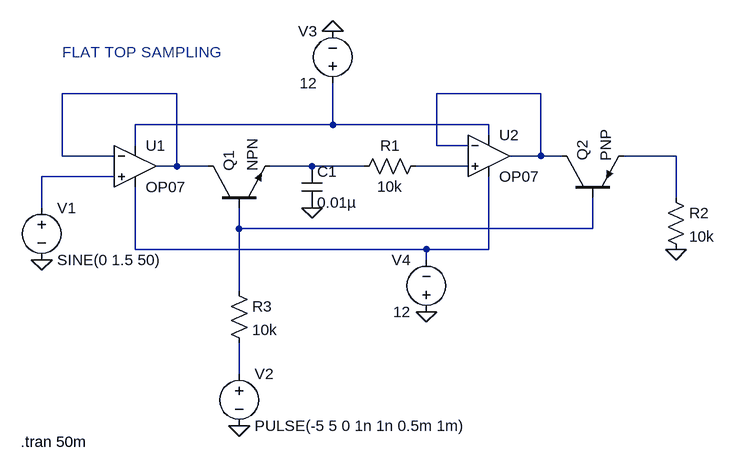
[diagram p0: schematic Flat_top_sampling.asc]
Flat_top_sampling.asc, the LTspice schematic file:
Version 4
SHEET 1 880 680
WIRE 16 32 -160 32
WIRE 576 32 416 32
WIRE 256 80 256 16
WIRE 256 80 -48 80
WIRE 496 80 256 80
WIRE 496 96 496 80
WIRE -48 112 -48 80
WIRE 416 112 416 32
WIRE 464 112 416 112
WIRE -160 128 -160 32
WIRE -80 128 -160 128
WIRE 576 128 576 32
WIRE 576 128 528 128
WIRE 608 128 576 128
WIRE 784 128 704 128
WIRE 16 144 16 32
WIRE 16 144 -16 144
WIRE 64 144 16 144
WIRE 224 144 160 144
WIRE 304 144 224 144
WIRE 464 144 384 144
WIRE -80 160 -192 160
WIRE 784 192 784 128
WIRE -192 208 -192 160
WIRE 112 240 112 208
WIRE 656 240 656 192
WIRE 656 240 112 240
WIRE -48 272 -48 176
WIRE 400 272 -48 272
WIRE 496 272 496 160
WIRE 496 272 400 272
WIRE 400 288 400 272
WIRE 112 336 112 240
WIRE 112 464 112 416
FLAG -192 288 0
FLAG 112 544 0
FLAG 224 208 0
FLAG 784 272 0
FLAG 400 368 0
FLAG 256 -64 0
SYMBOL OpAmps\\OP07 -48 80 R0
SYMATTR InstName U1
SYMBOL OpAmps\\OP07 496 64 R0
SYMATTR InstName U2
SYMBOL voltage -192 192 R0
WINDOW 123 0 0 Left 0
WINDOW 39 0 0 Left 0
SYMATTR InstName V1
SYMATTR Value SINE(0 1.5 50)
SYMBOL npn 64 208 R270
SYMATTR InstName Q1
SYMBOL res 400 128 R90
WINDOW 0 0 56 VBottom 2
WINDOW 3 32 56 VTop 2
SYMATTR InstName R1
SYMATTR Value 10k
SYMBOL cap 208 144 R0
SYMATTR InstName C1
SYMATTR Value 0.01µ
SYMBOL pnp 608 192 R270
SYMATTR InstName Q2
SYMBOL res 768 176 R0
SYMATTR InstName R2
SYMATTR Value 10k
SYMBOL voltage 112 448 R0
WINDOW 123 0 0 Left 0
WINDOW 39 0 0 Left 0
SYMATTR InstName V2
SYMATTR Value PULSE(-5 5 0 1n 1n 0.5m 1m)
SYMBOL res 96 320 R0
SYMATTR InstName R3
SYMATTR Value 10k
SYMBOL voltage 256 32 R180
WINDOW 0 24 96 Left 2
WINDOW 3 24 16 Left 2
WINDOW 123 0 0 Left 0
WINDOW 39 0 0 Left 0
SYMATTR InstName V3
SYMATTR Value 12
SYMBOL voltage 400 384 R180
WINDOW 0 24 96 Left 2
WINDOW 3 24 16 Left 2
WINDOW 123 0 0 Left 0
WINDOW 39 0 0 Left 0
SYMATTR InstName V4
SYMATTR Value 12
TEXT -224 568 Left 2 !.tran 50m
TEXT -160 -32 Left 2 ;FLAT TOP SAMPLING

The netlist it stands for:
* Flat_top_sampling.asc
XU1 N007 N001 N003 N009 N001 LT1001  ; OP07, pins In+ In- V+ V- OUT
XU2 N006 N002 N003 N009 N002 LT1001  ; OP07, pins In+ In- V+ V- OUT
V1 N007 0 SINE(0 1.5 50)
Q1 N001 N008 N005 0 NPN
R1 N006 N005 10k
C1 N005 0 0.01µ
Q2 N002 N008 N004 0 PNP
R2 N004 0 10k
V2 N010 0 PULSE(-5 5 0 1n 1n 0.5m 1m)
R3 N008 N010 10k
V3 N003 0 12
V4 0 N009 12
.model NPN NPN
.model PNP PNP
.lib standard.bjt
.tran 50m
* FLAT TOP SAMPLING
.lib LTC.lib
.backanno
.end